# EasyEDA schematic OCC Test- RailCom.json
TITLE: Sheet_1; REV: 1.0; Date: 2026-03-19; Sheet: 1/1; Drawn By: helmut-f; Company: Your Company
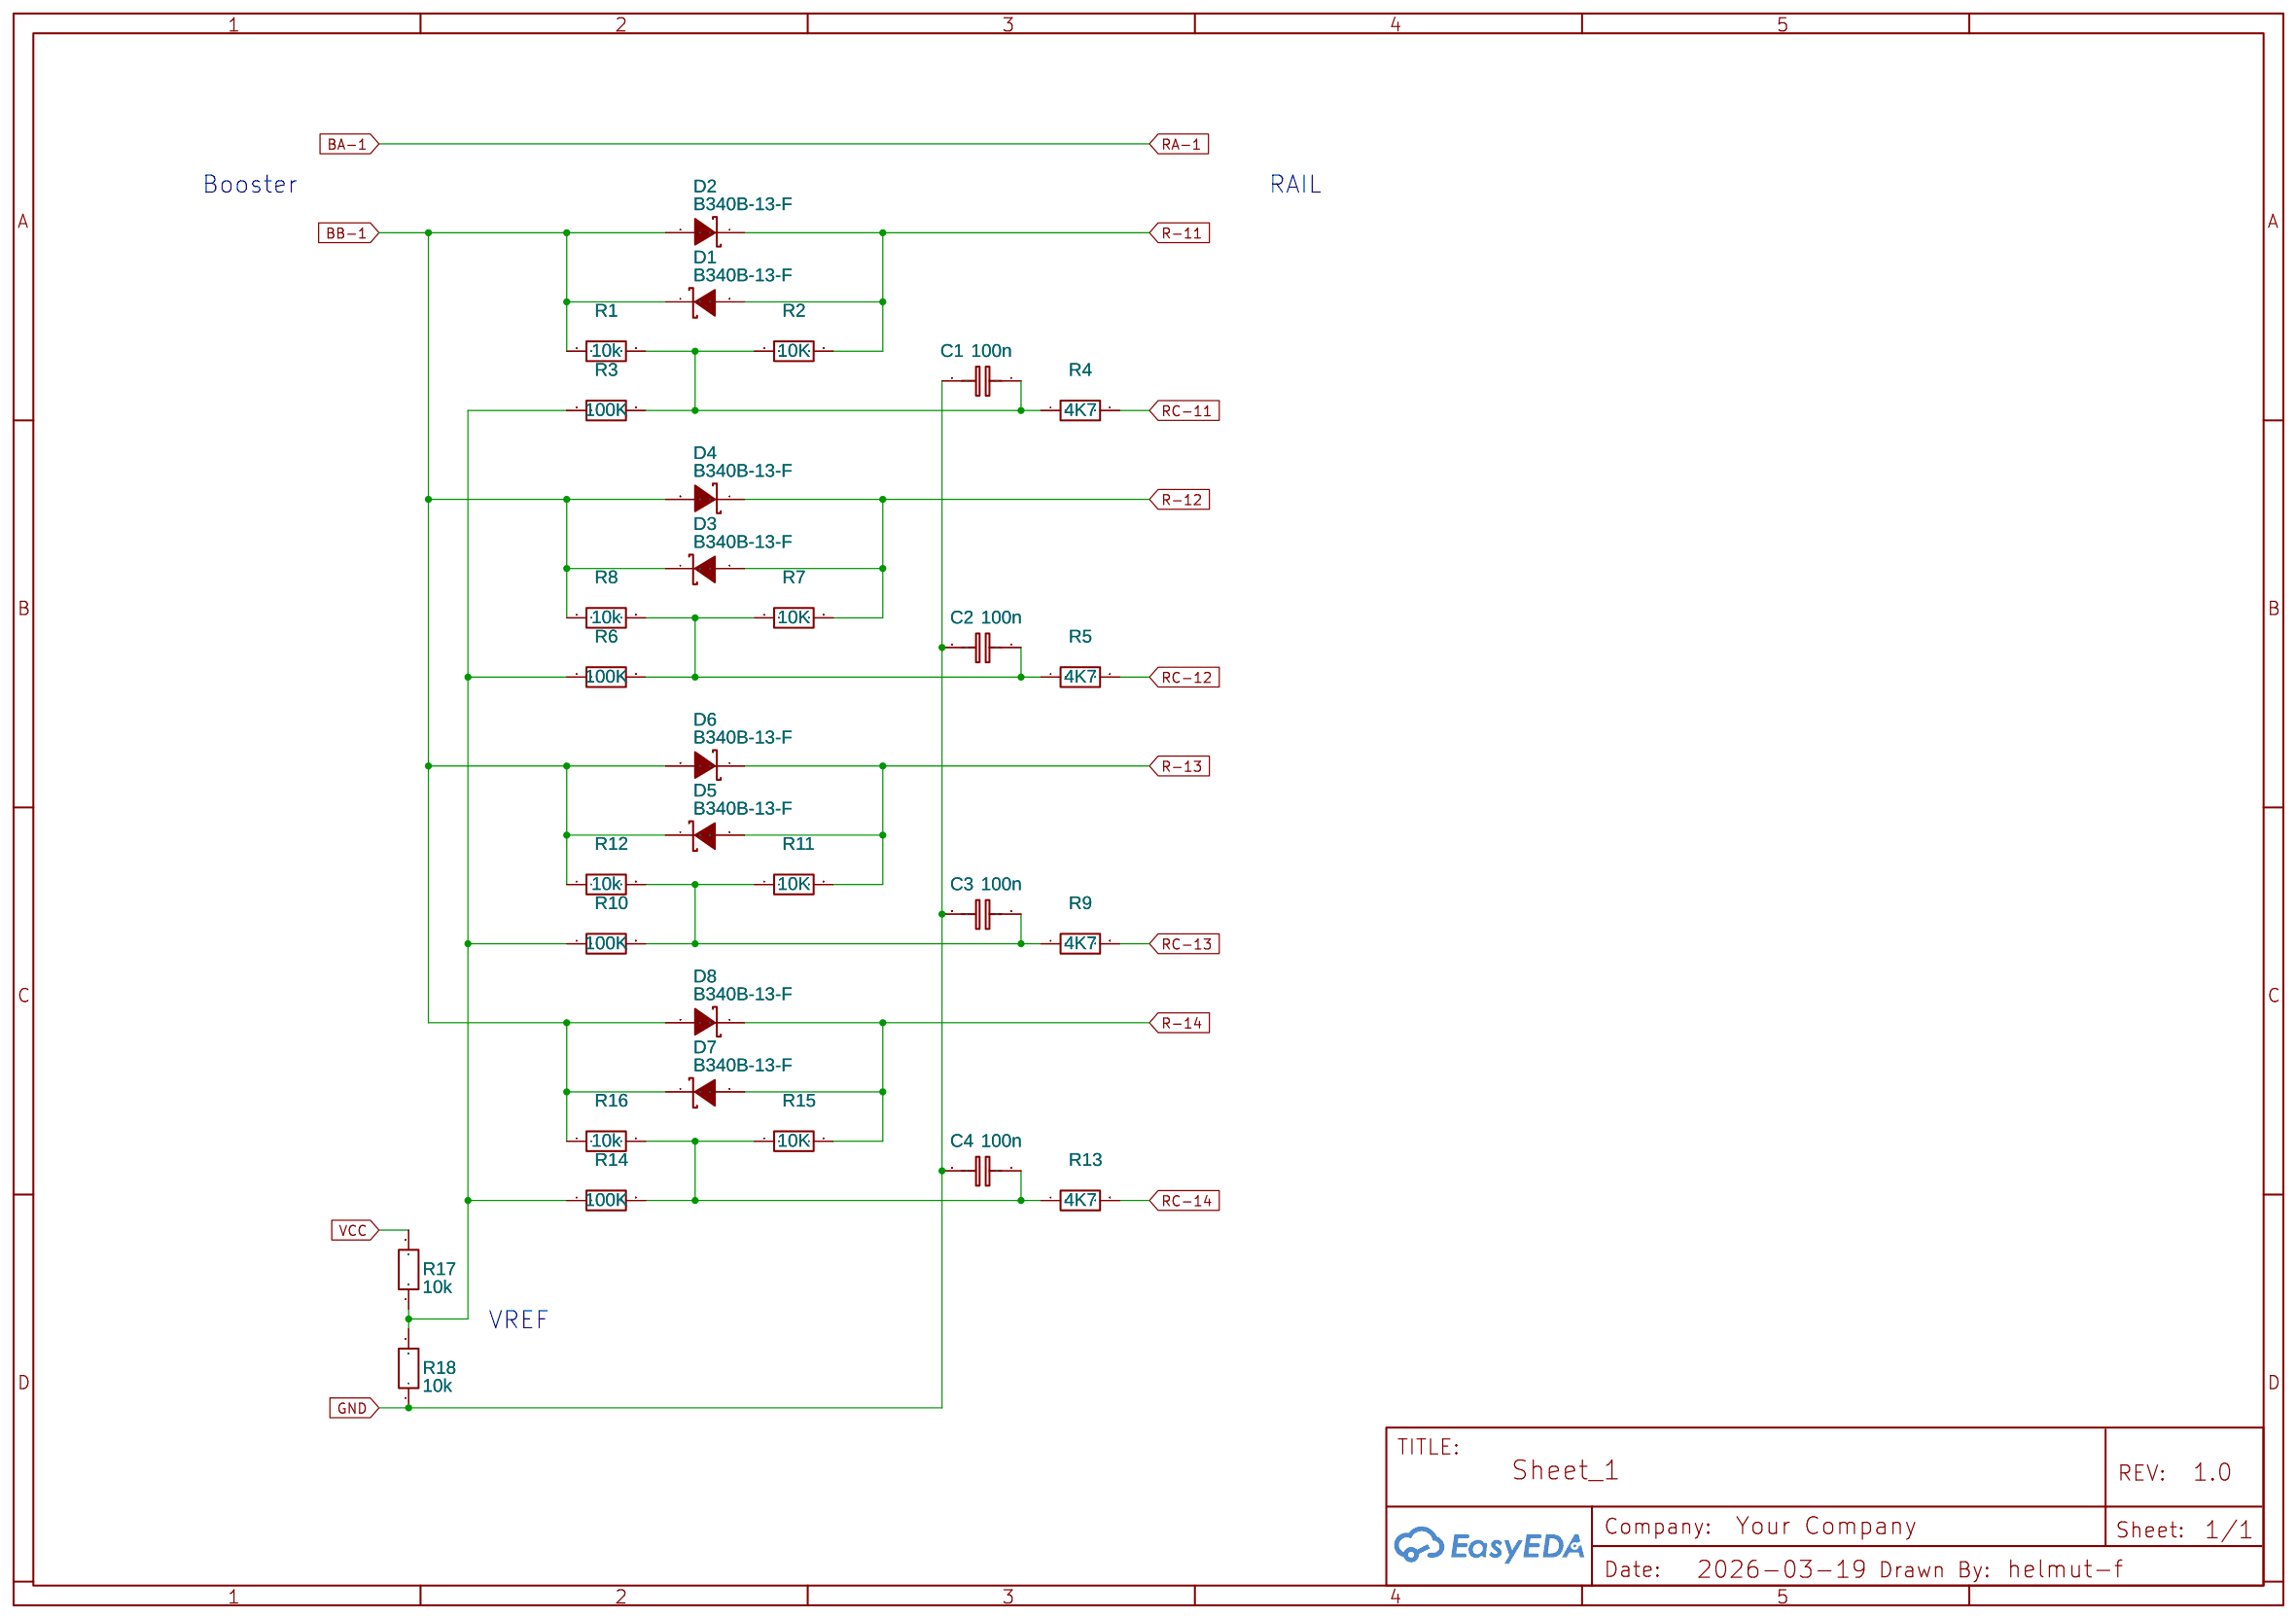
[diagram p0: schematic sheet]

## Parts
C1  100n  [C1206]
C2  100n  [C1206]
C3  100n  [C1206]
C4  100n  [C1206]
D1  B340B-13-F  [SMB_L4.6-W3.6-LS5.3-RD]
D2  B340B-13-F  [SMB_L4.6-W3.6-LS5.3-RD]
D3  B340B-13-F  [SMB_L4.6-W3.6-LS5.3-RD]
D4  B340B-13-F  [SMB_L4.6-W3.6-LS5.3-RD]
D5  B340B-13-F  [SMB_L4.6-W3.6-LS5.3-RD]
D6  B340B-13-F  [SMB_L4.6-W3.6-LS5.3-RD]
D7  B340B-13-F  [SMB_L4.6-W3.6-LS5.3-RD]
D8  B340B-13-F  [SMB_L4.6-W3.6-LS5.3-RD]
R1  10k  [R1206]
R2  10K  [R1206]
R3  100K  [R1206]
R4  4K7  [R1206]
R5  4K7  [R1206]
R6  100K  [R1206]
R7  10K  [R1206]
R8  10k  [R1206]
R9  4K7  [R1206]
R10  100K  [R1206]
R11  10K  [R1206]
R12  10k  [R1206]
R13  4K7  [R1206]
R14  100K  [R1206]
R15  10K  [R1206]
R16  10k  [R1206]
R17  10k  [R1206]
R18  10k  [R1206]

## Library data of the parts
C1-C4 = C_1206_EU: Contributor: LCEDA_Lib
D1-D8 = B340B-13-F: Supplier: LCSC; Manufacturer: DIODES(美台); Supplier Part: C85099; JLCPCB Part Class: Extended Part
R1-R18 = R_1206_EU: Contributor: LCEDA_Lib

## Nets
GND: C1.2 C2.2 C3.2 C4.2 R18.1
VCC: R17.2
BB-1: D1.1(K) D2.2(A) D3.1(K) D4.2(A) D5.1(K) D6.2(A) D7.1(K) D8.2(A) R1.1 R8.1 R12.1 R16.1
R-11: D1.2(A) D2.1(K) R2.2
R-12: D3.2(A) D4.1(K) R7.2
R-13: D5.2(A) D6.1(K) R11.2
R-14: D7.2(A) D8.1(K) R15.2
RC-11: R4.2
RC-12: R5.2
RC-13: R9.2
RC-14: R13.2
Net-(C1-1): C1.1 R1.2 R2.1 R3.2 R4.1
Net-(C2-1): C2.1 R5.1 R6.2 R7.1 R8.2
Net-(C3-1): C3.1 R9.1 R10.2 R11.1 R12.2
Net-(C4-1): C4.1 R13.1 R14.2 R15.1 R16.2
Net-(R3-1): R3.1 R6.1 R10.1 R14.1 R17.1 R18.2

## Notes on the sheet
- Booster
- RAIL
- VREF
